# Altium schematic sheet 03-Headers.SchDoc
size A
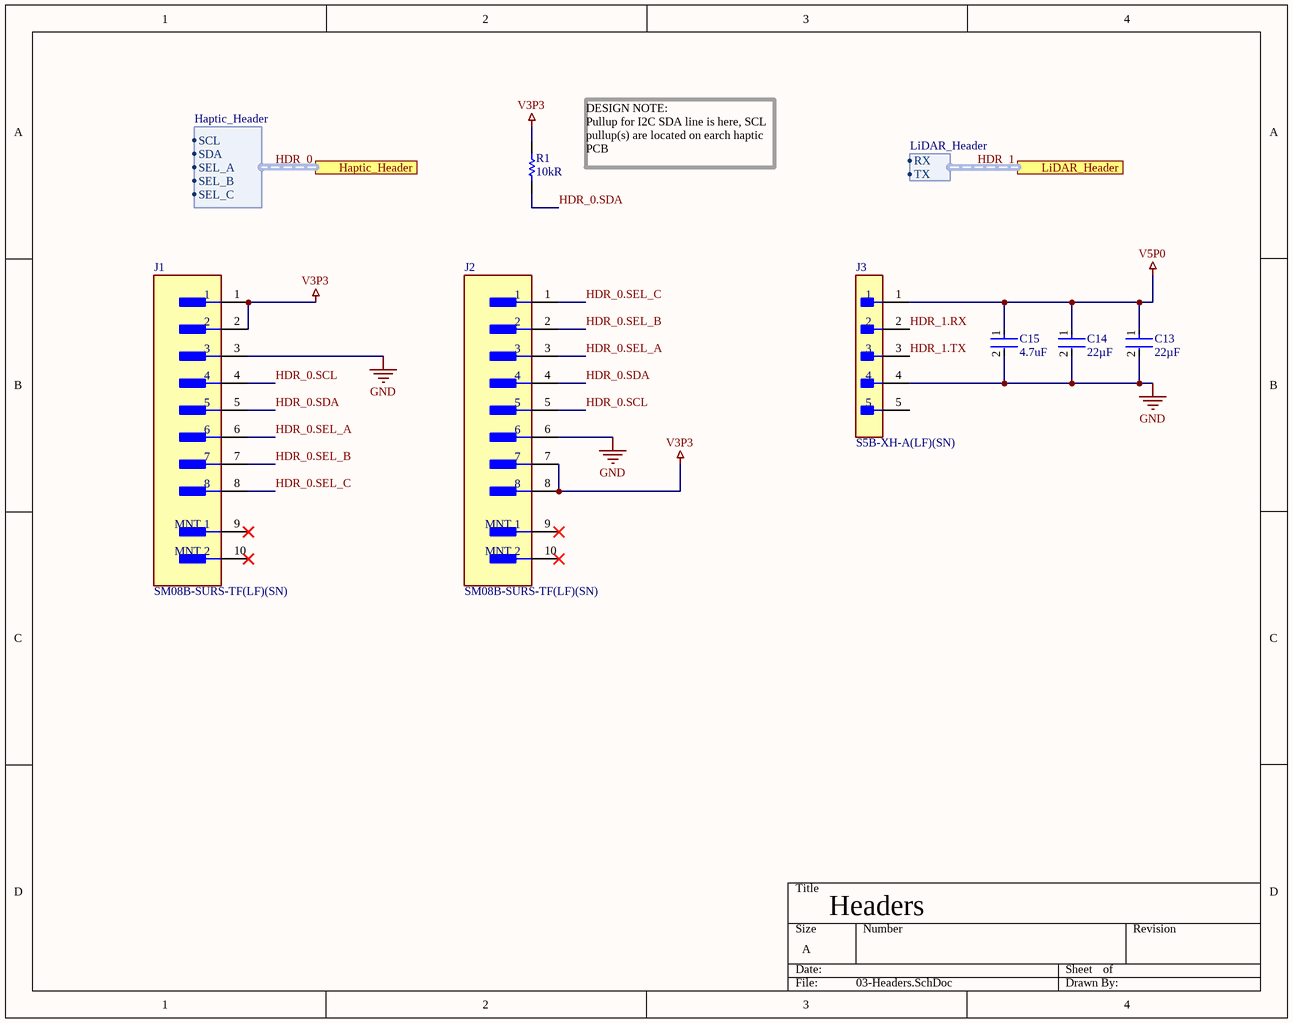
[diagram p0: 03-Headers.SchDoc]

## Parts
C13  22µF  [FP-GRM21B-0_2-e0_2_0_7-IPC_B]
C14  22µF  [FP-GRM21B-0_2-e0_2_0_7-IPC_B]
C15  4.7uF  [FP-CC0805-0_85-MFG]
J1  SM08B-SURS-TF(LF)(SN)  [FP-SM08B-SURS-TF_LF_SN-MFG]
J2  SM08B-SURS-TF(LF)(SN)  [FP-SM08B-SURS-TF_LF_SN-MFG]
J3  S5B-XH-A(LF)(SN)  [FP-S5B-XH-A_LF_SN-MFG]
R1  Resistance: 10kR  [RESC2013X60X35NL10T20]  (hidden comment: RC0805FR-0710KL)

## Ports
Haptic_Header (harness Haptic_Header), LiDAR_Header (harness LiDAR_Header)

## Harnesses
Haptic_Header: SCL, SDA, SEL_A, SEL_B, SEL_C
LiDAR_Header: RX, TX

## Nets
GND: C13.2 C14.2 C15.2 J1.3 J2.6 J3.4
V3P3: J1.1 J1.2 J2.7 J2.8 R1.1
V5P0: C13.1 C14.1 C15.1 J3.1
HDR_0.SCL: J1.4 J2.5
HDR_0.SDA: J1.5 J2.4 R1.2
HDR_0.SEL_A: J1.6 J2.3
HDR_0.SEL_B: J1.7 J2.2
HDR_0.SEL_C: J1.8 J2.1
HDR_1.RX: J3.2
HDR_1.TX: J3.3

Not connected (* = marked no-connect by the designer): J1 9(MNT_1)* 10(MNT_2)*; J2 9(MNT_1)* 10(MNT_2)*; J3 5

## Buses and harness runs
harness HDR_0 = port Haptic_Header
harness HDR_1 = port LiDAR_Header

## Notes on the sheet
- DESIGN NOTE:
  Pullup for I2C SDA line is here, SCL pullup(s) are located on earch haptic PCB
- Headers

## Library data of the parts
C13 C14 = CMP-06035-023072-1: Chip Multilayer Ceramic Capacitors for General Purpose, 0805, 22uF, X7R, 15%, 20%, 10V
C15 = CMP-03422-001026-1: CC0805MKX7R8BB475 / CAP CER 4.7UF 25V X7R 0805; Manufacturer: Yageo; Material: Ceramic; Tolerance: 0.2; Ipc Land Pattern Name: CAPC200125X85; ComponentLink2Description: Datasheet; ComponentLink2URL: http://www.yageo.com/documents/recent/UPY-GPHC_Y5V_6.3V-to-50V_8.pdf; Lead Free: Yes; Mouser Description: Cap Cer 4.7UF 25V X7R 0805; Temperature: -30°C to +85°C; Device Class L3: Ceramic Capacitors; RoHS: TRUE; Height: 0.95mm; Temperature Range Low: -30°C; Device Class L2: Capacitors; Voltage Rating: 25 V; Temperature Characteristic: X7R; Value: 4.7 uF; Category: Cap; Digikey Description: CAP CER 4.7UF 25V X7R 0805; Package: CC0805-0.85; Footprint Url: http://www.yageo.com/exep/pages/download/literatures/UPY-C_GEN_24.pdf; Capacitance: 4.7 uF; Temperature Range High: +85°C; Manufacturer Part Number: CC0805MKX7R8BB475; Device Class L1: Passive Components; Octopart: https://octopart.com/cc0805mkx7r8bb475-yageo-81932647; Automotive: No
J1 J2 = CMP-17439-000103-1: CONN HEADER SMD R/A 8POS 0.8MM; Voltage Rating: 30V; Number of Poles: 8; Current Rating: 500mA; Gender: Male; Wire/Cable Gauge: 32AWG; Insulation Resistance: 100MR; Body Plating: Tin; Color: Natural; Mount: Surface Mount; Series: SUR; Packaging: Cut Tape; Number of Rows: 1; REACH SVHC: No SVHC; Lead Pitch: 0.8mm; Insulation Color: Natural; Contact Type: Outer Shroud Contact; Lead Free: Lead Free; Contact Plating: Tin; Working Voltage: 30V; Contact Shape: Rectangular; Min Operating Temperature: -25°C; Number of Positions: 8; Number of Contacts: 8; Pitch: 0.8mm; Fastening Type: Pull; Max Operating Temperature: 85°C; Material: Polyamide; Insulation Material: Nylon; Connector Type: Header; Termination: IDC; Contact Finish - Mating: TIN; Flammability Rating: UL94 V-0; Contact Material: Copper Alloy
J3 = CMP-17439-000302-1: CONN HEADER R/A 5POS 2.5MM; Contact Resistance: 10mR; Voltage Rating: 250V; Number of Contacts: 5; Current Rating: 3A; Insulation Resistance: 1GR; Wire/Cable Gauge: 22AWG; Number of Rows: 1; Contact Plating: Tin; Fastening Type: Detent; Contact Finish - Mating: TIN; Contact Material: Brass; Lead Free: Lead Free; Connector Type: Header; REACH SVHC: No SVHC; Insulation Color: Natural; Orientation: Right Angle; Contact Type: Male Pin; Pitch: 2.5mm; Contact Shape: Square; Series: XH; Color: Natural; Lead Pitch: 2.5mm; Mount: Through Hole; Termination: Solder; Max Operating Temperature: 85°C; Number of Positions: 5; Flammability Rating: UL94 V-0; Min Operating Temperature: -25°C; Packaging: Bulk; Voltage Rating (AC): 250V; Insulation Material: Nylon
R1 = CMP-1659-00013-4: DRV2605 I2C SDA pullup resistor / Chip Resistor, 10 KOhm, +/- 1%, 0.125 W, -55 to 155 degC, 0805 (2012 Metric), RoHS, Tape and Reel; Manufacturer: Yageo; Voltage Rating: 150 V; Power Rating: 125mW; Temperature Coefficient: 100ppm/°C; Mount: Surface Mount; ComponentLink1Description: Manufacturer URL; ComponentLink2URL: http://www.yageo.com/documents/recent/PYu-RC_Group_51_RoHS_L_04.pdf; Pins: 2; Length: 2 mm; Min Operating Temperature: -55 degC; Height: 0.5 mm; Mounting Technology: Surface Mount; RoHSCompliant: true; REACH SVHC: No SVHC; ComponentLink1URL: http://www.yageo.com/; Max Operating Temperature: 155 degC; PackageReference: 0805; DatasheetVersion: Rev. 4, 02/2016; Package Quantity: 5000; Packaging: Tape and Reel; ComponentLink2Description: Datasheet; PackageDescription: 2-Pin Surface Mounted Device, Body 2 x 1.25 mm; Supplier 1: Digi-Key; Supplier Part Number 1: 311-10.0KCRCT-ND; Manufacturer 1: Yageo; Manufacturer Part Number 1: RC0805FR-0710KL; RoHS: Yes; Category: Chip SMD Resistors; Stock 1: 12202331; Pricing 1: 1=0.10000, 10=0.03700, 100=0.01520, 1000=0.00682, 2500=0.00592 (USD); Case/Package: 0805; Case Code (Imperial): 0805; Case Code (Metric): 2012; Size Code: 0805; Tolerance: 1%; Termination: SMD/SMT; Series: RC; Max Power Dissipation: 125mW; Resistance Tolerance: 1%; Resistor Type: Thick Film; Number of Terminations: 2; Features: Moisture Resistant; Construction: Rectangular; Technology: THICK FILM; Width: 0.049inch; Depth: 1.25mm; RoHS Compliant: Yes; Lead Free: Lead Free; Military Standard: Not